# Altium schematic sheet PSU_MAX1556_DC-DC.SchDoc: MAX1556 DC-DC Supply
size A4; CheckedBy: D-820-0017; Author: NB2HND01; Organization: Altium Limited.; Address1: Level 3, 12a Rodborough Rd; Address2: Frenchs Forest 2086; Address3: NSW; Address4: AUSTRALIA; DocumentNumber: 13; Revision: .02; SheetNumber: 29; SheetTotal: 64; PageSetup: Record=PageOptions|CenterHorizontal=True|CenterVertical=True|PrintScale=0.97|XCorrection=1.00|YCorrection=1.00|PrintKind=0|BorderSize=5000000|LeftOffset=0|BottomOffset=0|Orientation=2|PaperLength=1000|PaperWidth=1000|Scale=100|PaperSource=7|PrintQuality=-4|MediaType=1|DitherType=10|PaperKind=A4|PrintScaleMode=1
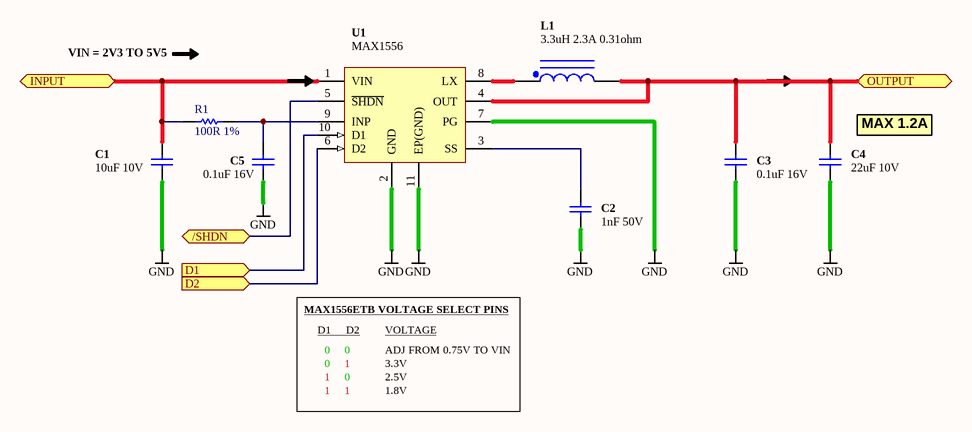
[diagram p0: PSU_MAX1556_DC-DC.SchDoc]

## Parts
C1  10uF 10V  [CAPC2012-STAR]
C2  1nF 50V  [CAPC1005-STAR]
C3  0.1uF 16V  [CAPC1005-STAR]
C4  22uF 10V  [CAPC3225-STAR]
C5  0.1uF 16V  [CAPC1005-STAR]
L1  3.3uH 2.3A 0.31ohm  [B82462G4xxxM]
R1  100R 1%  [RESC1005-STAR]
U1  MAX1556  [QFN50P300X300X80-10L]

## Ports
/SHDN, D1 (in), D2 (in), INPUT, OUTPUT

## Nets
GND: C1.2 C2.1 C3.1 C4.2 C5.1 U1.2(GND) U1.7(PG) U1.11(EP(GND))
/SHDN: U1.5(~{SHDN}) ; port /SHDN
D1: U1.10(D1) ; port D1
D2: U1.6(D2) ; port D2
INPUT: C1.1 R1.1 U1.1(VIN) ; port INPUT
OUTPUT: C3.2 C4.1 L1.2 U1.4(OUT) ; port OUTPUT
NetC2_2: C2.2 U1.3(SS)
NetC5_2: C5.2 R1.2 U1.9(INP)
NetL1_1: L1.1 U1.8(LX)

## Notes on the sheet
- VIN = 2V3 TO 5V5
- (near C4) MAX 1.2A
- MAX1556ETB VOLTAGE SELECT PINS
- D1     D2
- VOLTAGE
- 0
- 1
- ADJ FROM 0.75V TO VIN
- 3.3V
- 1.8V
- 2.5V
- Sheet Title
- Project Title
- Size:
- Date:
- A4
- Assy:
- Time:
- Revision:
- Sheet
- of
- File:

## Library data of the parts
C1 = D-101-0087: Capacitor, Ceramic, 10uF 10% 10V 0805 (2012) X5R; Polarity: Non-Polarized; Category: Capacitor; Capacitance: 10 uF; Dielectric: X5R; Mounting Technology: Surface Mount; Rated Voltage: 10 V; Status: Unreleased; Technology: None; Tolerance: 10 %
C2 = D-101-0030: Capacitor, Ceramic, 1nF 10% 50V 0402 (1005) X7R; Polarity: Non-Polarized; Category: Capacitor; Capacitance: 1 nF; Dielectric: X7R; Mounting Technology: Surface Mount; Rated Voltage: 50 V; Status: Production; Technology: Ceramic; Tolerance: 10 %
C3 C5 = D-101-0080: Capacitor, Ceramic, 0.1uF 10% 16V 0402 (1005) X7R; Manufactured Item Id: M-101-0099; Manufactured Item Id 1: M-101-0100; Polarity: Non-Polarized; Old Design Item Id: CAP-NP-0.1uF-16V-0805; Category: Capacitor; Capacitance: 0.1 uF; Dielectric: X7R; Mounting Technology: Surface Mount; Rated Voltage: 16 V; Status: Production; Technology: Ceramic; Tolerance: 10 %
C4 = D-101-0021: Capacitor, Ceramic, 22uF -20%/+80% 10V 1210 (3225) Y5V; Polarity: Non-Polarized; Tolerance: -20 / +80 %; Category: Capacitor; Capacitance: 22 uF; Dielectric: Y5V; Mounting Technology: Surface Mount; Rated Voltage: 10 V; Status: Production; Technology: Ceramic
L1 = D-102-0018: Inductor, Chip 3.3uH, 2.3A, 0.31ohm; Category: Inductor; Inductance: 3.3 uH; Max Input Current: 2.3 A; Mounting Technology: Surface Mount; Status: Unreleased
R1 = D-100-0131: Resistor, 100R 1% 0402 (1005); Power Rating: 63 mW; Mounting Technology: Surface Mount; Resistance: 100 R; Status: Production; Tolerance: 1 %; Category: Resistor
U1 = D-204-0022: 16uA IQ, 1.2A PWM  Step-Down DC-DC Converters; Max Input Voltage: 20 V; Max Output Current: 300 mA; Min Input Voltage: -20 V; Supply Voltage: -20 - +20 V; Status: Unreleased; Category: IC-Power; Mounting Technology: Surface Mount; Temperature Range: -40 to +85; Max Output Voltage: 20 V; Min Output Voltage: -20 V